# Altium schematic sheet main.SchDoc
size A2
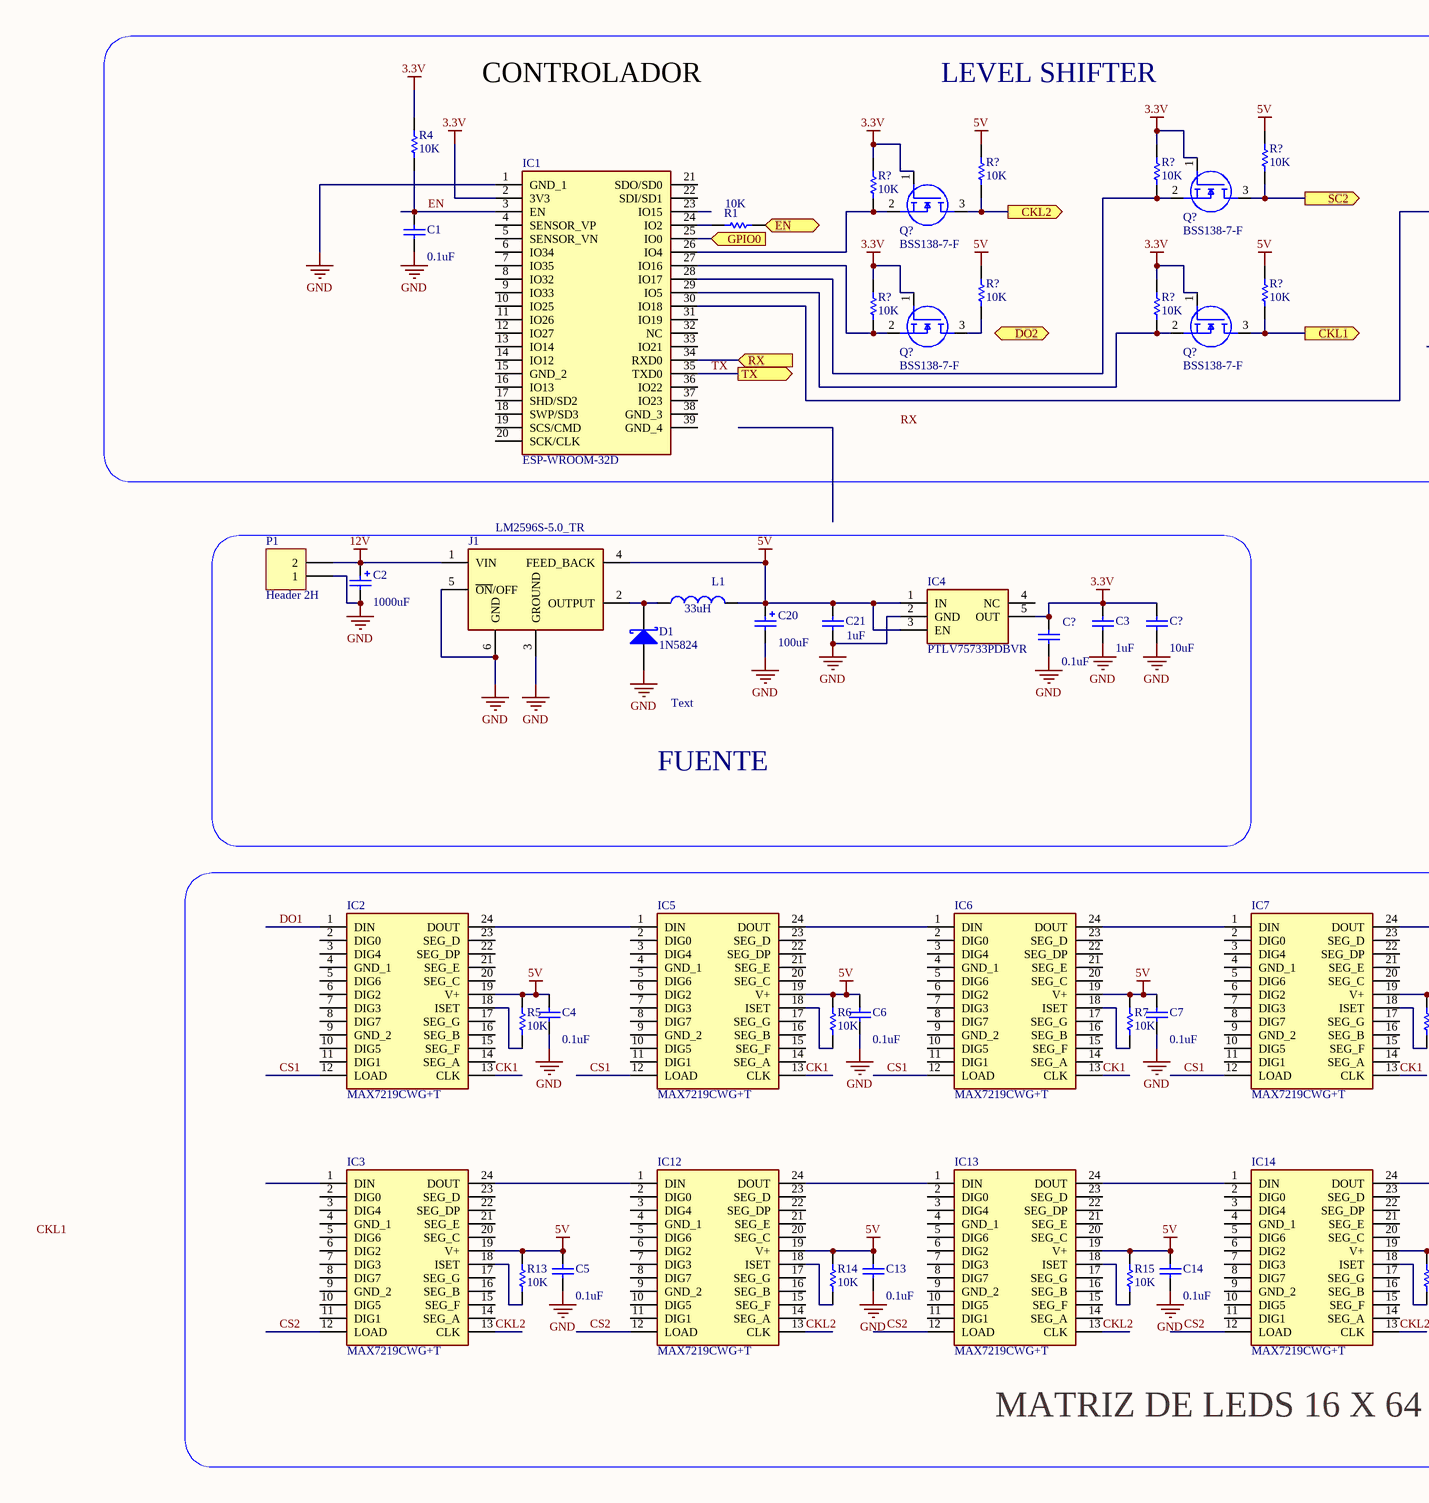
[diagram p0: main.SchDoc, left]
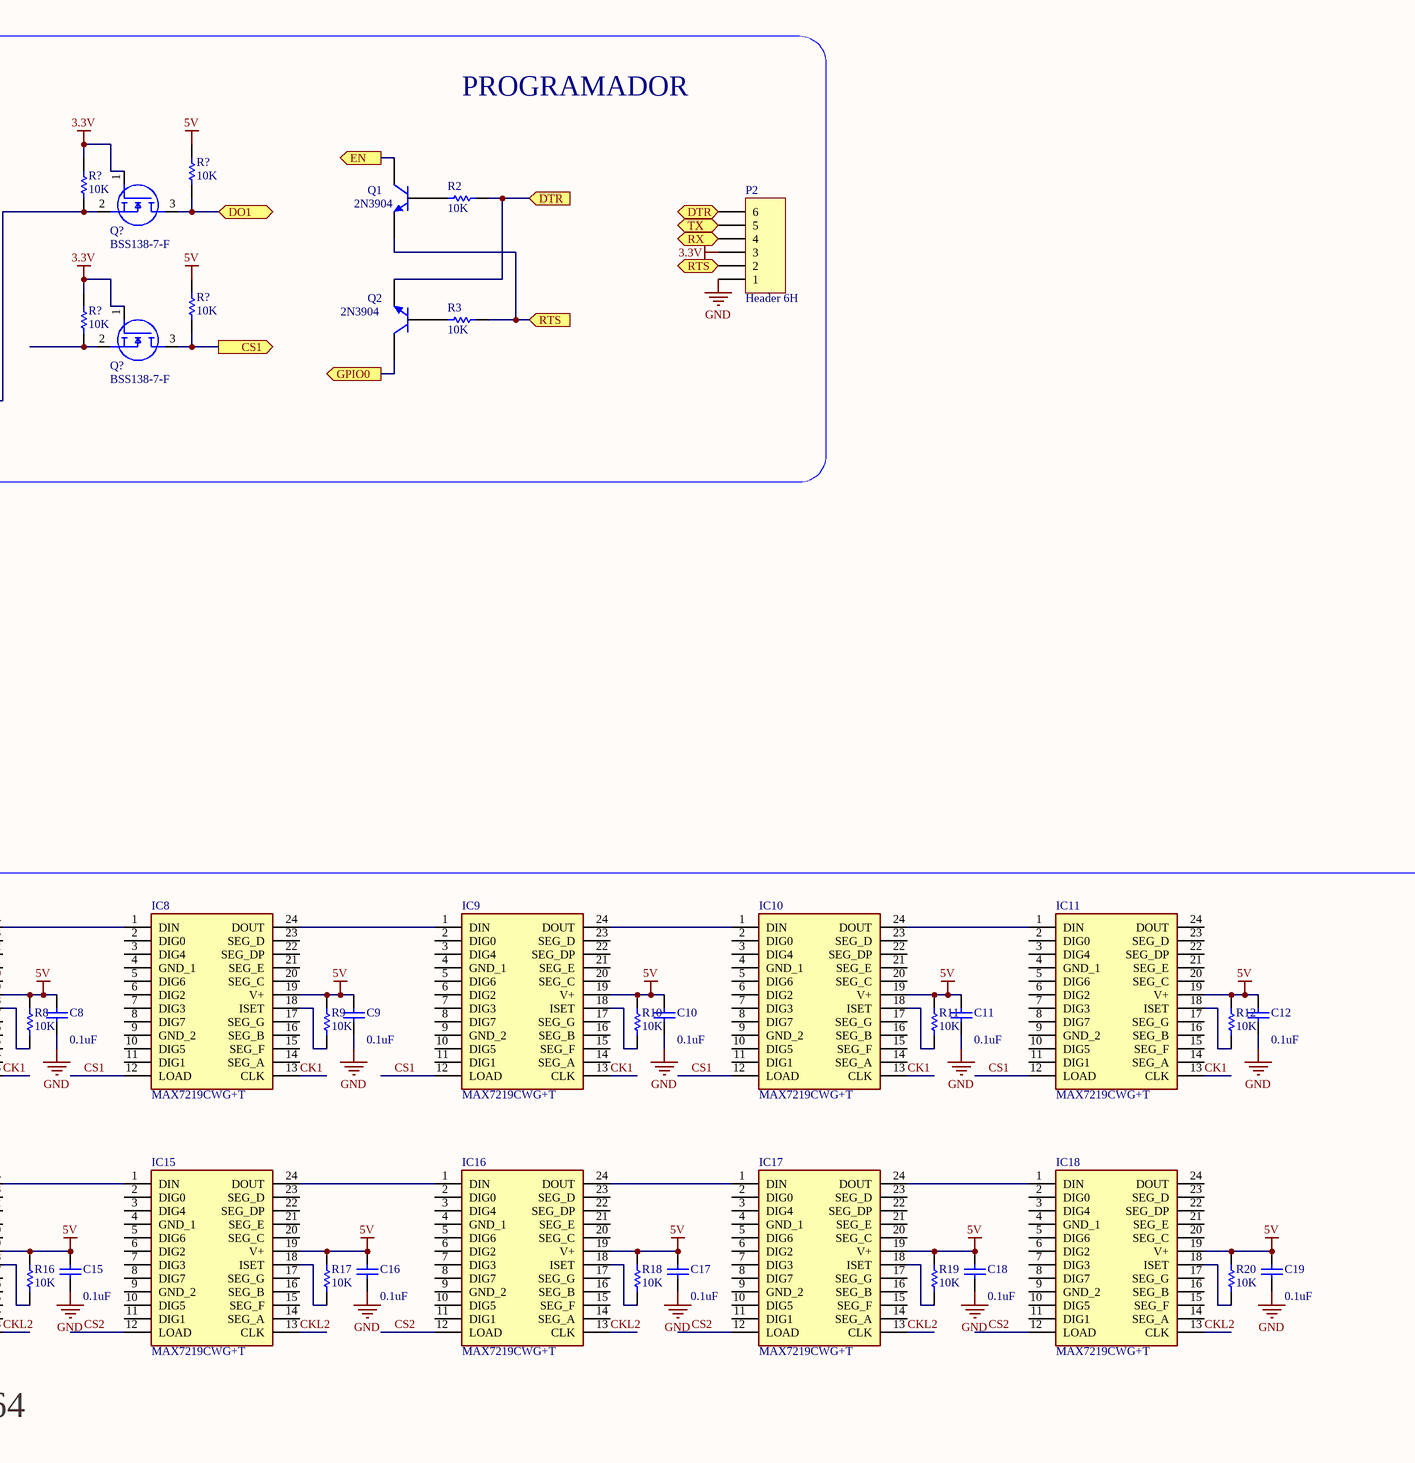
[diagram p1: main.SchDoc, right]

## Parts
(Parts that share a designator on the sheet are numbered #1, #2 ... from top to bottom, then left to right.)
C1  value 0.1uF  [6-0805_M]  (hidden comment: Cap)
C2  value 1000uF  [RB7.6-15]  (hidden comment: Cap Pol1)
C3  value 1uF  [6-0805_M]  (hidden comment: Cap)
C4  value 0.1uF  [6-0805_M]  (hidden comment: Cap)
C5  value 0.1uF  [6-0805_M]  (hidden comment: Cap)
C6  value 0.1uF  [6-0805_M]  (hidden comment: Cap)
C7  value 0.1uF  [6-0805_M]  (hidden comment: Cap)
C8  value 0.1uF  [6-0805_M]  (hidden comment: Cap)
C9  value 0.1uF  [6-0805_M]  (hidden comment: Cap)
C10  value 0.1uF  [6-0805_M]  (hidden comment: Cap)
C11  value 0.1uF  [6-0805_M]  (hidden comment: Cap)
C12  value 0.1uF  [6-0805_M]  (hidden comment: Cap)
C13  value 0.1uF  [6-0805_M]  (hidden comment: Cap)
C14  value 0.1uF  [6-0805_M]  (hidden comment: Cap)
C15  value 0.1uF  [6-0805_M]  (hidden comment: Cap)
C16  value 0.1uF  [6-0805_M]  (hidden comment: Cap)
C17  value 0.1uF  [6-0805_M]  (hidden comment: Cap)
C18  value 0.1uF  [6-0805_M]  (hidden comment: Cap)
C19  value 0.1uF  [6-0805_M]  (hidden comment: Cap)
C20  value 100uF  [RB7.6-15]  (hidden comment: Cap Pol1)
C21  value 1uF  [6-0805_M]  (hidden comment: Cap)
C?#1  value 10uF  [6-0805_M]  (hidden comment: Cap)
C?#2  value 0.1uF  [6-0805_M]  (hidden comment: Cap)
D1  1N5824  [TO-220AC]
IC1  ESP-WROOM-32D  [ESPWROOM32D]
IC2  MAX7219CWG+T  [SOIC127P1032X265-24N]
IC3  MAX7219CWG+T  [SOIC127P1032X265-24N]
IC4  PTLV75733PDBVR  [SOT95P280X145-5N]
IC5  MAX7219CWG+T  [SOIC127P1032X265-24N]
IC6  MAX7219CWG+T  [SOIC127P1032X265-24N]
IC7  MAX7219CWG+T  [SOIC127P1032X265-24N]
IC8  MAX7219CWG+T  [SOIC127P1032X265-24N]
IC9  MAX7219CWG+T  [SOIC127P1032X265-24N]
IC10  MAX7219CWG+T  [SOIC127P1032X265-24N]
IC11  MAX7219CWG+T  [SOIC127P1032X265-24N]
IC12  MAX7219CWG+T  [SOIC127P1032X265-24N]
IC13  MAX7219CWG+T  [SOIC127P1032X265-24N]
IC14  MAX7219CWG+T  [SOIC127P1032X265-24N]
IC15  MAX7219CWG+T  [SOIC127P1032X265-24N]
IC16  MAX7219CWG+T  [SOIC127P1032X265-24N]
IC17  MAX7219CWG+T  [SOIC127P1032X265-24N]
IC18  MAX7219CWG+T  [SOIC127P1032X265-24N]
J1  LM2596S-5.0_TR  [LM2596S50TR]
L1  value 33uH  [0402-A]  (hidden comment: Inductor)
P1  Header 2H  [HDR1X2H]
P2  Header 6H  [HDR1X6H]
Q1  2N3904  [SOT23_M]
Q2  2N3904  [SOT23_M]
Q?#1  BSS138-7-F  [BSS1387F]
Q?#2  BSS138-7-F  [BSS1387F]
Q?#3  BSS138-7-F  [BSS1387F]
Q?#4  BSS138-7-F  [BSS1387F]
Q?#5  BSS138-7-F  [BSS1387F]
Q?#6  BSS138-7-F  [BSS1387F]
R1  value 10K  [6-0805_M]  (hidden comment: Res1)
R2  value 10K  [6-0805_M]  (hidden comment: Res1)
R3  value 10K  [6-0805_M]  (hidden comment: Res1)
R4  value 10K  [6-0805_M]  (hidden comment: Res1)
R5  value 10K  [6-0805_M]  (hidden comment: Res1)
R6  value 10K  [6-0805_M]  (hidden comment: Res1)
R7  value 10K  [6-0805_M]  (hidden comment: Res1)
R8  value 10K  [6-0805_M]  (hidden comment: Res1)
R9  value 10K  [6-0805_M]  (hidden comment: Res1)
R10  value 10K  [6-0805_M]  (hidden comment: Res1)
R11  value 10K  [6-0805_M]  (hidden comment: Res1)
R12  value 10K  [6-0805_M]  (hidden comment: Res1)
R13  value 10K  [6-0805_M]  (hidden comment: Res1)
R14  value 10K  [6-0805_M]  (hidden comment: Res1)
R15  value 10K  [6-0805_M]  (hidden comment: Res1)
R16  value 10K  [6-0805_M]  (hidden comment: Res1)
R17  value 10K  [6-0805_M]  (hidden comment: Res1)
R18  value 10K  [6-0805_M]  (hidden comment: Res1)
R19  value 10K  [6-0805_M]  (hidden comment: Res1)
R20  value 10K  [6-0805_M]  (hidden comment: Res1)
R?#1  value 10K  [6-0805_M]  (hidden comment: Res1)
R?#2  value 10K  [6-0805_M]  (hidden comment: Res1)
R?#3  value 10K  [6-0805_M]  (hidden comment: Res1)
R?#4  value 10K  [6-0805_M]  (hidden comment: Res1)
R?#5  value 10K  [6-0805_M]  (hidden comment: Res1)
R?#6  value 10K  [6-0805_M]  (hidden comment: Res1)
R?#7  value 10K  [6-0805_M]  (hidden comment: Res1)
R?#8  value 10K  [6-0805_M]  (hidden comment: Res1)
R?#9  value 10K  [6-0805_M]  (hidden comment: Res1)
R?#10  value 10K  [6-0805_M]  (hidden comment: Res1)
R?#11  value 10K  [6-0805_M]  (hidden comment: Res1)
R?#12  value 10K  [6-0805_M]  (hidden comment: Res1)

## Blocks framed on the sheet
FUENTE: C2 C3 C20 C21 C?#1 C?#2 D1 IC4 J1 L1 P1
MATRIZ DE LEDS 16 X 64: C4-C19 IC2 IC3 IC5-IC18 R5-R20

## Ports
CKL1 (out), CKL2 (out), CS1 (out), DO1, DO2 (out), DTR (in), DTR (out), EN (in), EN (out), GPIO0 (in), GPIO0 (out), RTS (in), RTS (out), RX (in), RX (out), SC2 (out), TX (in), TX (out)

## Nets
3.3V: C3.2 C?#1.2 C?#2.2 IC1.2(3V3) IC4.5(OUT) P2.3 Q?#1.1(G) Q?#2.1(G) Q?#3.1(G) Q?#4.1(G) Q?#5.1(G) Q?#6.1(G) R4.2 R?#3.1 R?#5.1 R?#6.1 R?#9.1 R?#10.1 R?#12.1
5V: C4.1 C5.1 C6.1 C7.1 C8.1 C9.1 C10.1 C11.1 C12.1 C13.1 C14.1 C15.1 C16.1 C17.1 C18.1 C19.1 C20.1 C21.2 IC2.19(V+) IC3.19(V+) IC4.1(IN) IC4.3(EN) IC5.19(V+) IC6.19(V+) IC7.19(V+) IC8.19(V+) IC9.19(V+) IC10.19(V+) IC11.19(V+) IC12.19(V+) IC13.19(V+) IC14.19(V+) IC15.19(V+) IC16.19(V+) IC17.19(V+) IC18.19(V+) J1.4(FEED_BACK) L1.2 R5.2 R6.2 R7.2 R8.2 R9.2 R10.2 R11.2 R12.2 R13.2 R14.2 R15.2 R16.2 R17.2 R18.2 R19.2 R20.2 R?#1.1 R?#2.1 R?#4.1 R?#7.1 R?#8.1 R?#11.1
12V: C2.1 J1.1(VIN) P1.2
GND: C1.1 C2.2 C3.1 C4.2 C5.2 C6.2 C7.2 C8.2 C9.2 C10.2 C11.2 C12.2 C13.2 C14.2 C15.2 C16.2 C17.2 C18.2 C19.2 C20.2 C21.1 C?#1.1 C?#2.1 D1.3(A) IC1.1(GND_1) IC4.2(GND) J1.3(GROUND) J1.5(~{ON}/OFF) J1.6(GND) P1.1 P2.1
CK1: IC2.13(CLK) IC5.13(CLK) IC6.13(CLK) IC7.13(CLK) IC8.13(CLK) IC9.13(CLK) IC10.13(CLK) IC11.13(CLK)
CKL1: Q?#5.3(D) R?#8.2 ; port CKL1
CKL2: IC3.13(CLK) IC12.13(CLK) IC13.13(CLK) IC14.13(CLK) IC15.13(CLK) IC16.13(CLK) IC17.13(CLK) IC18.13(CLK)
CKL2: Q?#2.3(D) R?#2.2 ; port CKL2  [a separate net that carries the same name]
CS1: IC2.12(LOAD) IC5.12(LOAD) IC6.12(LOAD) IC7.12(LOAD) IC8.12(LOAD) IC9.12(LOAD) IC10.12(LOAD) IC11.12(LOAD)
CS1: Q?#6.3(D) R?#11.2 ; port CS1  [a separate net that carries the same name]
CS2: IC3.12(LOAD) IC12.12(LOAD) IC13.12(LOAD) IC14.12(LOAD) IC15.12(LOAD) IC16.12(LOAD) IC17.12(LOAD) IC18.12(LOAD)
DO1: IC2.1(DIN)
DO1: Q?#3.3(D) R?#4.2 ; port DO1  [a separate net that carries the same name]
DTR: P2.6 Q2.1(E) R2.1 ; port DTR
EN: C1.2 IC1.3(EN) R4.1
EN: Q1.3(C) R1.1 ; port EN  [a separate net that carries the same name]
GPIO0: IC1.25(IO0) Q2.3(C) ; port GPIO0
RTS: P2.2 Q1.1(E) R3.1 ; port RTS
RX: IC1.34(RXD0) P2.4 ; port RX
SC2: Q?#1.3(D) R?#1.2 ; port SC2
TX: IC1.35(TXD0) P2.5 ; port TX
NetD1_1: D1.1(K) J1.2(OUTPUT) L1.1
NetIC1_24: IC1.24(IO2) R1.2
NetIC1_26: IC1.26(IO4) Q?#2.2(S) R?#5.2
NetIC1_27: IC1.27(IO16) Q?#4.2(S) R?#9.2
NetIC1_28: IC1.28(IO17) Q?#1.2(S) R?#3.2
NetIC1_29: IC1.29(IO5) Q?#5.2(S) R?#10.2
NetIC1_30: IC1.30(IO18) Q?#3.2(S) R?#6.2
NetIC2_18: IC2.18(ISET) R5.1
NetIC2_24: IC2.24(DOUT) IC5.1(DIN)
NetIC3_18: IC3.18(ISET) R13.1
NetIC3_24: IC3.24(DOUT) IC12.1(DIN)
NetIC5_18: IC5.18(ISET) R6.1
NetIC5_24: IC5.24(DOUT) IC6.1(DIN)
NetIC6_18: IC6.18(ISET) R7.1
NetIC6_24: IC6.24(DOUT) IC7.1(DIN)
NetIC7_18: IC7.18(ISET) R8.1
NetIC7_24: IC7.24(DOUT) IC8.1(DIN)
NetIC8_18: IC8.18(ISET) R9.1
NetIC8_24: IC8.24(DOUT) IC9.1(DIN)
NetIC9_18: IC9.18(ISET) R10.1
NetIC9_24: IC9.24(DOUT) IC10.1(DIN)
NetIC10_18: IC10.18(ISET) R11.1
NetIC10_24: IC10.24(DOUT) IC11.1(DIN)
NetIC11_18: IC11.18(ISET) R12.1
NetIC12_18: IC12.18(ISET) R14.1
NetIC12_24: IC12.24(DOUT) IC13.1(DIN)
NetIC13_18: IC13.18(ISET) R15.1
NetIC13_24: IC13.24(DOUT) IC14.1(DIN)
NetIC14_18: IC14.18(ISET) R16.1
NetIC14_24: IC14.24(DOUT) IC15.1(DIN)
NetIC15_18: IC15.18(ISET) R17.1
NetIC15_24: IC15.24(DOUT) IC16.1(DIN)
NetIC16_18: IC16.18(ISET) R18.1
NetIC16_24: IC16.24(DOUT) IC17.1(DIN)
NetIC17_18: IC17.18(ISET) R19.1
NetIC17_24: IC17.24(DOUT) IC18.1(DIN)
NetIC18_18: IC18.18(ISET) R20.1
NetQ1_2: Q1.2(B) R2.2
NetQ2_2: Q2.2(B) R3.2
NetQ?#4_3: Q?#4.3(D) R?#7.2
NetQ?#6_2: Q?#6.2(S) R?#12.2

Not connected (* = marked no-connect by the designer): IC1 4(SENSOR_VP) 5(SENSOR_VN) 6(IO34) 7(IO35) 8(IO32) 9(IO33) 10(IO25) 11(IO26) 12(IO27) 13(IO14) 14(IO12) 15(GND_2) 16(IO13) 17(SHD/SD2) 18(SWP/SD3) 19(SCS/CMD) 20(SCK/CLK) 21(SDO/SD0) 22(SDI/SD1) 23(IO15) 31(IO19) 32(NC) 33(IO21) 36(IO22) 37(IO23) 38(GND_3) 39(GND_4); IC2 2(DIG0) 3(DIG4) 4(GND_1) 5(DIG6) 6(DIG2) 7(DIG3) 8(DIG7) 9(GND_2) 10(DIG5) 11(DIG1) 14(SEG_A) 15(SEG_F) 16(SEG_B) 17(SEG_G) 20(SEG_C) 21(SEG_E) 22(SEG_DP) 23(SEG_D); IC3 1(DIN) 2(DIG0) 3(DIG4) 4(GND_1) 5(DIG6) 6(DIG2) 7(DIG3) 8(DIG7) 9(GND_2) 10(DIG5) 11(DIG1) 14(SEG_A) 15(SEG_F) 16(SEG_B) 17(SEG_G) 20(SEG_C) 21(SEG_E) 22(SEG_DP) 23(SEG_D); IC4 4(NC); IC5 2(DIG0) 3(DIG4) 4(GND_1) 5(DIG6) 6(DIG2) 7(DIG3) 8(DIG7) 9(GND_2) 10(DIG5) 11(DIG1) 14(SEG_A) 15(SEG_F) 16(SEG_B) 17(SEG_G) 20(SEG_C) 21(SEG_E) 22(SEG_DP) 23(SEG_D); IC6 2(DIG0) 3(DIG4) 4(GND_1) 5(DIG6) 6(DIG2) 7(DIG3) 8(DIG7) 9(GND_2) 10(DIG5) 11(DIG1) 14(SEG_A) 15(SEG_F) 16(SEG_B) 17(SEG_G) 20(SEG_C) 21(SEG_E) 22(SEG_DP) 23(SEG_D); IC7 2(DIG0) 3(DIG4) 4(GND_1) 5(DIG6) 6(DIG2) 7(DIG3) 8(DIG7) 9(GND_2) 10(DIG5) 11(DIG1) 14(SEG_A) 15(SEG_F) 16(SEG_B) 17(SEG_G) 20(SEG_C) 21(SEG_E) 22(SEG_DP) 23(SEG_D); IC8 2(DIG0) 3(DIG4) 4(GND_1) 5(DIG6) 6(DIG2) 7(DIG3) 8(DIG7) 9(GND_2) 10(DIG5) 11(DIG1) 14(SEG_A) 15(SEG_F) 16(SEG_B) 17(SEG_G) 20(SEG_C) 21(SEG_E) 22(SEG_DP) 23(SEG_D); IC9 2(DIG0) 3(DIG4) 4(GND_1) 5(DIG6) 6(DIG2) 7(DIG3) 8(DIG7) 9(GND_2) 10(DIG5) 11(DIG1) 14(SEG_A) 15(SEG_F) 16(SEG_B) 17(SEG_G) 20(SEG_C) 21(SEG_E) 22(SEG_DP) 23(SEG_D); IC10 2(DIG0) 3(DIG4) 4(GND_1) 5(DIG6) 6(DIG2) 7(DIG3) 8(DIG7) 9(GND_2) 10(DIG5) 11(DIG1) 14(SEG_A) 15(SEG_F) 16(SEG_B) 17(SEG_G) 20(SEG_C) 21(SEG_E) 22(SEG_DP) 23(SEG_D); IC11 2(DIG0) 3(DIG4) 4(GND_1) 5(DIG6) 6(DIG2) 7(DIG3) 8(DIG7) 9(GND_2) 10(DIG5) 11(DIG1) 14(SEG_A) 15(SEG_F) 16(SEG_B) 17(SEG_G) 20(SEG_C) 21(SEG_E) 22(SEG_DP) 23(SEG_D) 24(DOUT); IC12 2(DIG0) 3(DIG4) 4(GND_1) 5(DIG6) 6(DIG2) 7(DIG3) 8(DIG7) 9(GND_2) 10(DIG5) 11(DIG1) 14(SEG_A) 15(SEG_F) 16(SEG_B) 17(SEG_G) 20(SEG_C) 21(SEG_E) 22(SEG_DP) 23(SEG_D); IC13 2(DIG0) 3(DIG4) 4(GND_1) 5(DIG6) 6(DIG2) 7(DIG3) 8(DIG7) 9(GND_2) 10(DIG5) 11(DIG1) 14(SEG_A) 15(SEG_F) 16(SEG_B) 17(SEG_G) 20(SEG_C) 21(SEG_E) 22(SEG_DP) 23(SEG_D); IC14 2(DIG0) 3(DIG4) 4(GND_1) 5(DIG6) 6(DIG2) 7(DIG3) 8(DIG7) 9(GND_2) 10(DIG5) 11(DIG1) 14(SEG_A) 15(SEG_F) 16(SEG_B) 17(SEG_G) 20(SEG_C) 21(SEG_E) 22(SEG_DP) 23(SEG_D); IC15 2(DIG0) 3(DIG4) 4(GND_1) 5(DIG6) 6(DIG2) 7(DIG3) 8(DIG7) 9(GND_2) 10(DIG5) 11(DIG1) 14(SEG_A) 15(SEG_F) 16(SEG_B) 17(SEG_G) 20(SEG_C) 21(SEG_E) 22(SEG_DP) 23(SEG_D); IC16 2(DIG0) 3(DIG4) 4(GND_1) 5(DIG6) 6(DIG2) 7(DIG3) 8(DIG7) 9(GND_2) 10(DIG5) 11(DIG1) 14(SEG_A) 15(SEG_F) 16(SEG_B) 17(SEG_G) 20(SEG_C) 21(SEG_E) 22(SEG_DP) 23(SEG_D); IC17 2(DIG0) 3(DIG4) 4(GND_1) 5(DIG6) 6(DIG2) 7(DIG3) 8(DIG7) 9(GND_2) 10(DIG5) 11(DIG1) 14(SEG_A) 15(SEG_F) 16(SEG_B) 17(SEG_G) 20(SEG_C) 21(SEG_E) 22(SEG_DP) 23(SEG_D); IC18 2(DIG0) 3(DIG4) 4(GND_1) 5(DIG6) 6(DIG2) 7(DIG3) 8(DIG7) 9(GND_2) 10(DIG5) 11(DIG1) 14(SEG_A) 15(SEG_F) 16(SEG_B) 17(SEG_G) 20(SEG_C) 21(SEG_E) 22(SEG_DP) 23(SEG_D) 24(DOUT)

## Notes on the sheet
- CONTROLADOR
- LEVEL SHIFTER
- PROGRAMADOR
- Text
- Labels drawn without touching a wire or pin: CKL1, RX

## Library data of the parts
C1 C3-C19 C21 C?#1 C?#2 = Cap: Capacitor; Published: 8-Jun-2000; LatestRevisionDate: 17-Jul-2002; LatestRevisionNote: Re-released for DXP Platform.; PackageReference: RAD-0.3; Publisher: Altium Limited; PackageDescription: Radial Cap, Thru-Hole; 2 Leads; 0.3 in Pin Spacing
C2 C20 = Cap Pol1: Polarized Capacitor (Radial); Published: 8-Jun-2000; LatestRevisionDate: 17-Jul-2002; LatestRevisionNote: Re-released for DXP Platform.; PackageReference: RB7.6-15; Publisher: Altium Limited; PackageDescription: Polarized Capacitor (Radial); 2 Leads
D1 = Diode 10TQ040: Schottky Rectifier; Note: Terminal 2 is the TAB and is electrically connected to the cathode; Published: 8-Jun-2000; LatestRevisionDate: 17-Jul-2002; LatestRevisionNote: Re-released for DXP Platform.; DatasheetVersion: PD-2.057B; PackageVersion: Feb-1998; PackageReference: TO-220AC; Publisher: Altium Limited; PackageDescription: TO, Thru-Hole, Vertical, Heatsink Mounted; 3 In-Line Leads (1 Absent); Pitch 2.54 mm; ComponentLink1Description: Manufacturer Link; ComponentLink1URL: http://www.irf.com/
IC1 = ESP-WROOM-32D: Integrated Circuit; Manufacturer_Name: Espressif Systems; Datasheet Link: https://componentsearchengine.com/Datasheets/1/ESP-WROOM-32D.pdf; Height: 3.2mm; Manufacturer_Part_Number: ESP-WROOM-32D; Arrow Part Number: ESP-WROOM-32D; Mouser Part Number: 356-ESP-WROOM-32D; Mouser Price/Stock: https://www.mouser.com/Search/Refine.aspx?Keyword=356-ESP-WROOM-32D
IC2 IC3 IC5-IC18 = MAX7219CWG+T: Integrated Circuit; Manufacturer_Name: Maxim Integrated; Datasheet Link: https://componentsearchengine.com//MAX7219CWG+T.pdf; Height: 2.65mm; Mouser2 Part Number: 700-MAX7219CWGT; Mouser2 Price/Stock: https://www.mouser.com/Search/Refine.aspx?Keyword=700-MAX7219CWGT; Manufacturer_Part_Number: MAX7219CWG+T
IC4 = PTLV75733PDBVR: Integrated Circuit; Manufacturer_Name: Texas Instruments; Datasheet Link: http://www.ti.com/lit/ds/symlink/tlv757p.pdf; Height: 1.45mm; Manufacturer_Part_Number: PTLV75733PDBVR; Arrow Part Number: PTLV75733PDBVR; Arrow Price/Stock: https://www.arrow.com/en/products/ptlv75733pdbvr/texas-instruments; Mouser Part Number: 595-PTLV75733PDBVR; Mouser Price/Stock: https://www.mouser.co.uk/ProductDetail/Texas-Instruments/PTLV75733PDBVR?qs=chTDxNqvsymJRvDJcx2n%252Bw%3D%3D
J1 = LM2596S-5.0_TR: Connector; Manufacturer_Name: National Electronics; Manufacturer_Part_Number: LM2596S-5.0/TR; Datasheet Link: https://www.jameco.com/Jameco/Products/ProdDS/895246.pdf; Height: 4.65mm; Arrow Part Number: LM2596S-5.0/TR
L1 = Inductor: Code_IEC: 1005; Published: 8-Jun-2000; LatestRevisionDate: 29-May-2009; LatestRevisionNote: IPC-7351 Footprint Added.; PackageReference: 0402-A; Publisher: Altium Limited; PackageDescription: Chip Inductor; Code_JEITA: 0402
P1 = Header 2H: Header, 2-Pin, Right Angle; LatestRevisionDate: 17-Jul-2002; LatestRevisionNote: Re-released for DXP Platform.; Publisher: Altium Limited
P2 = Header 6H: Header, 6-Pin, Right Angle; LatestRevisionDate: 17-Jul-2002; LatestRevisionNote: Re-released for DXP Platform.; Publisher: Altium Limited
Q1 Q2 = 2N3904: NPN General Purpose Amplifier; Published: 8-Jun-2000; LatestRevisionDate: 15-Jan-2003; LatestRevisionNote: PCB Footprint 'BCY-W3/D4.7' replaced; DatasheetVersion: 1997; PackageVersion: Sep-1998; PackageReference: TO-92A; Publisher: Altium Limited; PackageDescription: TO, Flat Index; 3 In-Line, Axial Leads; Body Dia. 4.5mm; Leads 0.51 x 0.48 mm (max); ComponentLink1Description: Manufacturer Link; ComponentLink1URL: http://www.fairchildsemi.com/; ComponentLink2Description: Datasheet; ComponentLink2URL: http://www.fairchildsemi.com/ds/2N%2F2N3904.pdf
Q?#1-Q?#6 = BSS138-7-F: MOSFET (N-Channel); Manufacturer_Name: MULTICOMP; Datasheet Link: https://componentsearchengine.com/Datasheets/2/BSS138-7-F.pdf; Height: 1.2mm; Manufacturer_Part_Number: BSS138-7-F; Arrow Part Number: BSS138-7-F
R1-R20 R?#1-R?#12 = Res1: Resistor; Published: 8-Jun-2000; LatestRevisionDate: 17-Jul-2002; LatestRevisionNote: Re-released for DXP Platform.; PackageReference: AXIAL-0.3; Publisher: Altium Limited; PackageDescription: Axial Device, Thru-Hole; 2 Leads; 0.3 in Pin Spacing